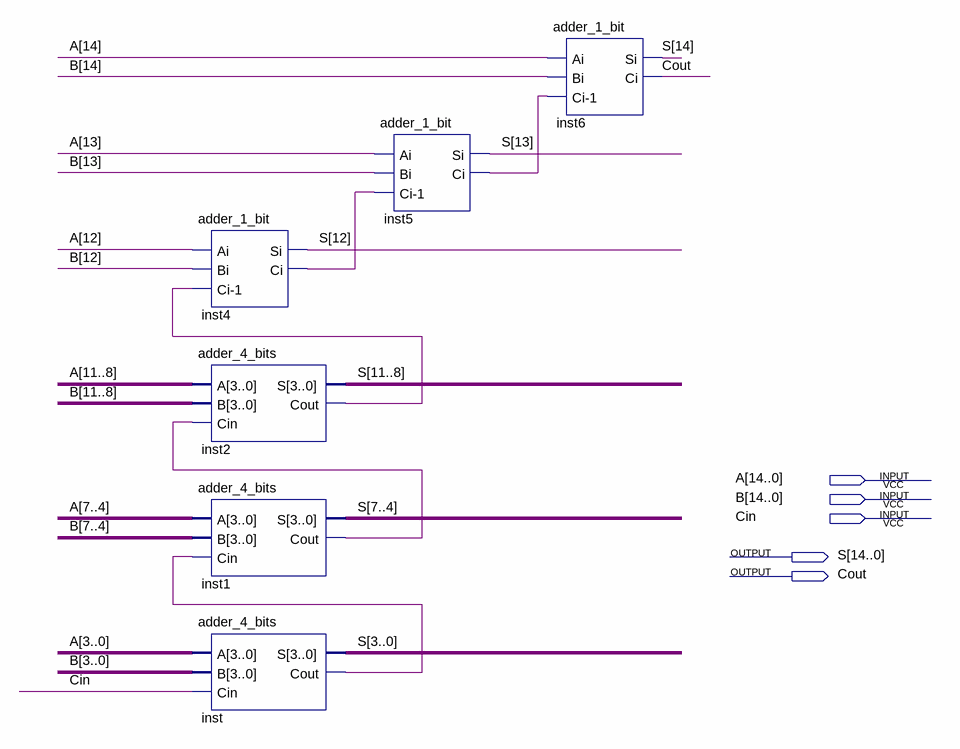
[diagram p0: schematic sheet]
// Quartus schematic adder_15_bits.bdf as structural Verilog: 6 symbols, 5 pins
module adder_15_bits (
  input  [14:0] A,
  input  [14:0] B,
  input  Cin,
  output [14:0] S,
  output Cout
);

  wire inst1_cout, inst2_cout, inst4_ci, inst5_ci, inst_cout;

  adder_1_bit inst4 (.Ai(A[12]), .Bi(B[12]), .\Ci-1 (inst2_cout), .Si(S[12]), .Ci(inst4_ci));
  adder_4_bits inst2 (.A(A[11:8]), .B(B[11:8]), .Cin(inst1_cout), .S(S[11:8]), .Cout(inst2_cout));
  adder_4_bits inst1 (.A(A[7:4]), .B(B[7:4]), .Cin(inst_cout), .S(S[7:4]), .Cout(inst1_cout));
  adder_4_bits inst (.A(A[3:0]), .B(B[3:0]), .Cin(Cin), .S(S[3:0]), .Cout(inst_cout));
  adder_1_bit inst5 (.Ai(A[13]), .Bi(B[13]), .\Ci-1 (inst4_ci), .Si(S[13]), .Ci(inst5_ci));
  adder_1_bit inst6 (.Ai(A[14]), .Bi(B[14]), .\Ci-1 (inst5_ci), .Si(S[14]), .Ci(Cout));
endmodule
